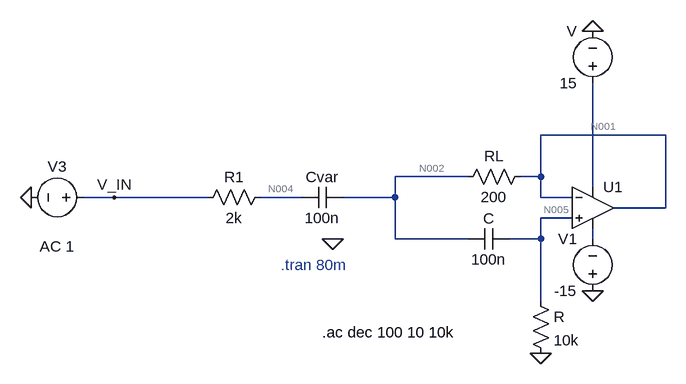
[diagram p0: schematic zyrator.asc]
zyrator.asc, the LTspice schematic file:
Version 4.1
SHEET 1 880 680
WIRE 448 -64 256 -64
WIRE 144 0 32 0
WIRE 256 0 256 -64
WIRE 256 0 224 0
WIRE 336 16 336 -144
WIRE -400 32 -448 32
WIRE -256 32 -400 32
WIRE -112 32 -176 32
WIRE 32 32 32 0
WIRE 32 32 -48 32
WIRE 256 32 256 0
WIRE 304 32 256 32
WIRE 448 48 448 -64
WIRE 448 48 368 48
WIRE 304 64 256 64
WIRE 32 96 32 32
WIRE 144 96 32 96
WIRE 256 96 256 64
WIRE 256 96 208 96
WIRE 336 96 336 80
WIRE 256 192 256 96
FLAG 256 272 0
FLAG 336 176 0
FLAG 336 -224 0
FLAG -528 32 0
FLAG -400 32 V_IN
FLAG -64 96 0
SYMBOL res 240 176 R0
SYMATTR InstName R
SYMATTR Value 10k
SYMBOL res 240 -16 R90
WINDOW 0 0 56 VBottom 2
WINDOW 3 32 56 VTop 2
SYMATTR InstName RL
SYMATTR Value 200
SYMBOL cap 208 80 R90
WINDOW 0 0 32 VBottom 2
WINDOW 3 32 32 VTop 2
SYMATTR InstName C
SYMATTR Value 100n
SYMBOL cap -112 48 R270
WINDOW 0 32 32 VTop 2
WINDOW 3 0 32 VBottom 2
SYMATTR InstName Cvar
SYMATTR Value 100n
SYMBOL voltage 336 -128 R180
WINDOW 0 24 96 Left 2
WINDOW 3 24 16 Left 2
WINDOW 123 0 0 Left 0
WINDOW 39 0 0 Left 0
SYMATTR InstName V
SYMATTR Value 15
SYMBOL voltage 336 192 R180
WINDOW 0 24 96 Left 2
WINDOW 3 24 16 Left 2
WINDOW 123 0 0 Left 0
WINDOW 39 0 0 Left 0
SYMATTR InstName V1
SYMATTR Value -15
SYMBOL voltage -432 32 R90
WINDOW 0 -32 56 VBottom 2
WINDOW 3 88 56 VTop 2
WINDOW 123 60 56 VTop 2
WINDOW 39 0 0 Left 0
SYMATTR InstName V3
SYMATTR Value ""
SYMATTR Value2 AC 1
SYMBOL OpAmps\\UniversalOpAmp 336 48 R0
SYMATTR InstName U1
SYMBOL res -160 16 R90
WINDOW 0 0 56 VBottom 2
WINDOW 3 32 56 VTop 2
SYMATTR InstName R1
SYMATTR Value 2k
TEXT -144 136 Left 2 ;.tran 80m
TEXT -80 240 Left 2 !.ac dec 100 10 10k

The netlist it stands for:
* zyrator.asc
R N005 0 10k
RL N001 N002 200
C N005 N002 100n
Cvar N004 N002 100n
V N003 0 15
V1 0 N006 -15
V3 V_IN 0 AC 1
X§U1 N005 N001 N003 N006 N001 level1 Avol=1Meg GBW=10Meg Vos=0 En=0 Enk=0 In=0 Ink=0 Rin=500Meg  ; pins In+ In- V+ V- OUT
R1 N004 V_IN 2k
* .tran 80m
.ac dec 100 10 10k
.lib UniversalOpAmp1.lib
.backanno
.end

* Results of the author's LTspice run, read from the files saved beside the schematic
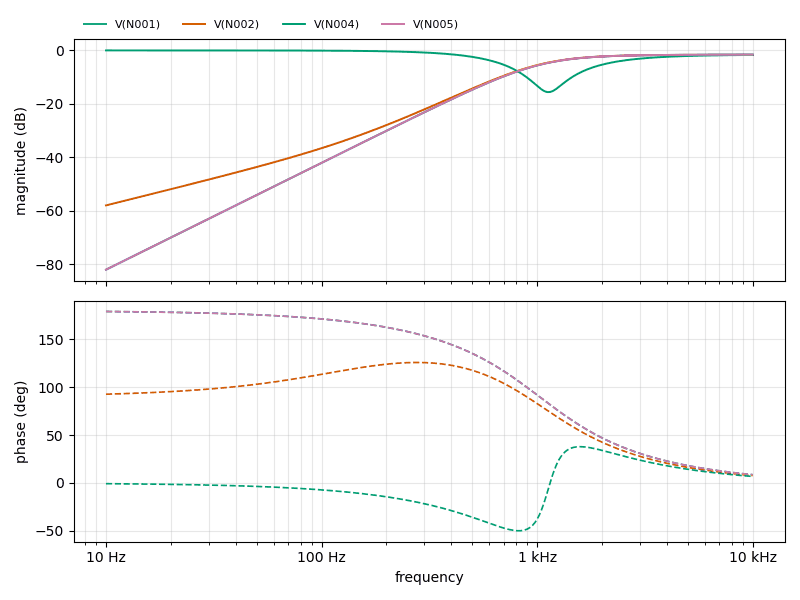
[diagram p1: AC Analysis of zyrator.asc, plotted from the saved traces]
* AC Analysis, 1 run:
*   V(N001): -82.05 dB at 10 Hz, -1.60 dB at 10 kHz, peak -1.60 dB at 10 kHz, 3 dB below the peak at 1.132 kHz
*   V(N002): -58.00 dB at 10 Hz, -1.60 dB at 10 kHz, peak -1.60 dB at 10 kHz, 3 dB below the peak at 1.119 kHz
*   V(N004): -0.00 dB at 10 Hz, -1.70 dB at 10 kHz, peak -0.00 dB at 10 Hz, 3 dB below the peak at 550.1 Hz
*   V(N005): -82.05 dB at 10 Hz, -1.60 dB at 10 kHz, peak -1.60 dB at 10 kHz, 3 dB below the peak at 1.132 kHz